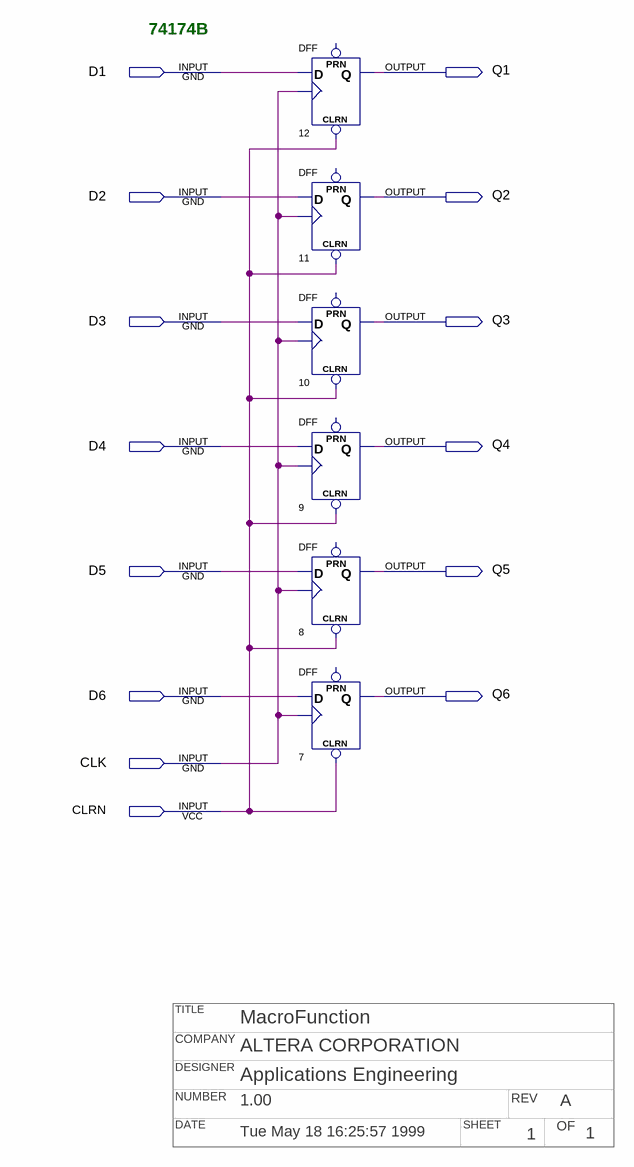
[diagram p0: schematic sheet]
// Quartus schematic 74174b.bdf as structural Verilog: 6 symbols, 14 pins
// Title block: TITLE: MacroFunction; COMPANY: ALTERA CORPORATION; DESIGNER: Applications Engineering; NUMBER: 1.00; REV: A; DATE: Tue May 18 16:25:57 1999; SHEET: 1; OF: 1
module \74174b  (
  input  D1,
  input  D2,
  input  D3,
  input  D4,
  input  D5,
  input  D6,
  input  CLK,
  input  CLRN,
  output Q1,
  output Q2,
  output Q3,
  output Q4,
  output Q5,
  output Q6
);

  DFF u_12 (.CLRN(CLRN), .CLK(CLK), .D(D1), .Q(Q1));  // open: PRN
  DFF u_11 (.CLRN(CLRN), .CLK(CLK), .D(D2), .Q(Q2));  // open: PRN
  DFF u_10 (.CLRN(CLRN), .CLK(CLK), .D(D3), .Q(Q3));  // open: PRN
  DFF u_9 (.CLRN(CLRN), .CLK(CLK), .D(D4), .Q(Q4));  // open: PRN
  DFF u_8 (.CLRN(CLRN), .CLK(CLK), .D(D5), .Q(Q5));  // open: PRN
  DFF u_7 (.CLRN(CLRN), .CLK(CLK), .D(D6), .Q(Q6));  // open: PRN

  // Notes on the sheet:
  //   74174B
endmodule
